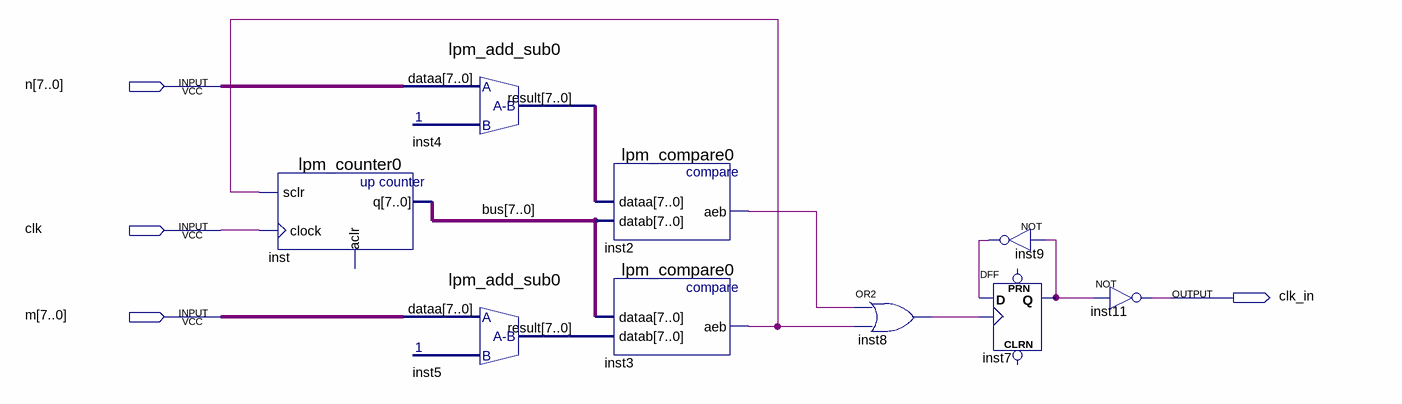
[diagram p0: schematic sheet]
// Quartus schematic Block1.bdf as structural Verilog: 9 symbols, 4 pins
module Block1 (
  input  [7:0] n,
  input  clk,
  input  [7:0] m,
  output clk_in
);

  wire inst2_aeb, inst3_aeb, inst7_q, inst8_out, inst9_out;
  wire [7:0] bus, inst4_result, inst5_result;

  lpm_counter0 inst (.sclr(inst3_aeb), .clock(clk), .q(bus));  // open: aclr
  lpm_add_sub0 inst4 (.dataa(n), .result(inst4_result));
  lpm_add_sub0 inst5 (.dataa(m), .result(inst5_result));
  lpm_compare0 inst2 (.dataa(inst4_result), .datab(bus), .aeb(inst2_aeb));
  lpm_compare0 inst3 (.dataa(bus), .datab(inst5_result), .aeb(inst3_aeb));
  or inst8 (inst8_out, inst2_aeb, inst3_aeb);
  not inst9 (inst9_out, inst7_q);
  DFF inst7 (.CLK(inst8_out), .D(inst9_out), .Q(inst7_q));  // open: CLRN, PRN
  not inst11 (clk_in, inst7_q);
endmodule
